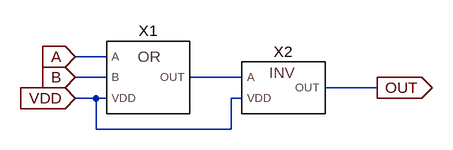
[diagram p0: schematic NORgdi.asc]
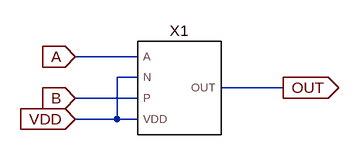
[diagram p1: sub-circuit orgdi.asc]
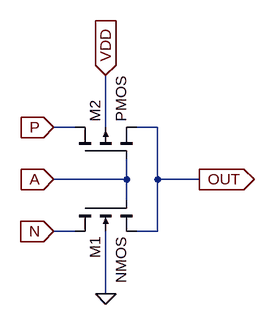
[diagram p2: sub-circuit gdicell.asc]
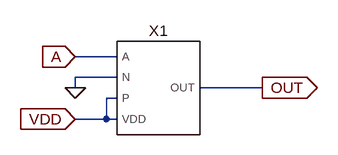
[diagram p3: sub-circuit invgdi.asc]
NORgdi.asc, the LTspice schematic file:
Version 4
SHEET 1 880 680
WIRE 80 112 32 112
WIRE 80 144 32 144
WIRE 288 144 208 144
WIRE 496 160 416 160
WIRE 64 176 32 176
WIRE 80 176 64 176
WIRE 288 176 272 176
WIRE 64 224 64 176
WIRE 272 224 272 176
WIRE 272 224 64 224
FLAG 32 112 A
IOPIN 32 112 In
FLAG 32 144 B
IOPIN 32 144 In
FLAG 32 176 VDD
IOPIN 32 176 In
FLAG 496 160 OUT
IOPIN 496 160 Out
SYMBOL ORgdi 144 144 R0
SYMATTR InstName X1
SYMBOL INVgdi 352 160 R0
SYMATTR InstName X2

orgdi.asc, the sub-circuit schematic file:
Version 4
SHEET 1 880 680
WIRE 160 112 64 112
WIRE 160 144 128 144
WIRE 384 160 288 160
WIRE 160 176 64 176
WIRE 128 208 128 144
WIRE 128 208 64 208
WIRE 160 208 128 208
FLAG 64 112 A
IOPIN 64 112 In
FLAG 64 176 B
IOPIN 64 176 In
FLAG 64 208 VDD
IOPIN 64 208 In
FLAG 384 160 OUT
IOPIN 384 160 Out
SYMBOL GDICell 224 160 R0
SYMATTR InstName X1

gdicell.asc, the sub-circuit schematic file:
Version 4
SHEET 1 880 680
WIRE 176 96 144 96
WIRE 224 96 224 16
WIRE 304 96 272 96
WIRE 256 176 256 144
WIRE 256 176 144 176
WIRE 304 176 304 96
WIRE 368 176 304 176
WIRE 256 208 256 176
WIRE 176 256 144 256
WIRE 304 256 304 176
WIRE 304 256 272 256
WIRE 224 352 224 256
FLAG 144 96 P
IOPIN 144 96 In
FLAG 144 256 N
IOPIN 144 256 In
FLAG 144 176 A
IOPIN 144 176 In
FLAG 368 176 OUT
IOPIN 368 176 Out
FLAG 224 16 VDD
IOPIN 224 16 In
FLAG 224 352 0
SYMBOL nmos4 176 208 M90
SYMATTR InstName M1
SYMATTR Value2 l=65nm w=65nm
SYMBOL pmos4 176 144 R270
SYMATTR InstName M2
SYMATTR Value2 l=162.5nm w=65nm

invgdi.asc, the sub-circuit schematic file:
Version 4
SHEET 1 880 680
WIRE 176 112 112 112
WIRE 176 144 112 144
WIRE 112 160 112 144
WIRE 400 160 304 160
WIRE 176 176 160 176
WIRE 160 208 160 176
WIRE 160 208 112 208
WIRE 176 208 160 208
FLAG 112 112 A
IOPIN 112 112 In
FLAG 112 208 VDD
IOPIN 112 208 In
FLAG 400 160 OUT
IOPIN 400 160 Out
FLAG 112 160 0
SYMBOL GDICell 240 160 R0
SYMATTR InstName X1

The netlist it stands for:
* NORgdi.asc
XX1 A B VDD N001 orgdi
XX2 N001 VDD OUT invgdi

* block symbol definitions
.subckt orgdi A B VDD OUT
XX1 A VDD B VDD OUT gdicell
.ends orgdi

.subckt gdicell A N P VDD OUT
M1 N A OUT 0 NMOS l=65nm w=65nm
M2 P A OUT VDD PMOS l=162.5nm w=65nm
.ends gdicell

.subckt invgdi A VDD OUT
XX1 A 0 VDD VDD OUT gdicell
.ends invgdi

.model NMOS NMOS
.model PMOS PMOS
.lib standard.mos
.backanno
.end